# EAGLE design MoleNet_v2 (EAGLE 7.5.0)
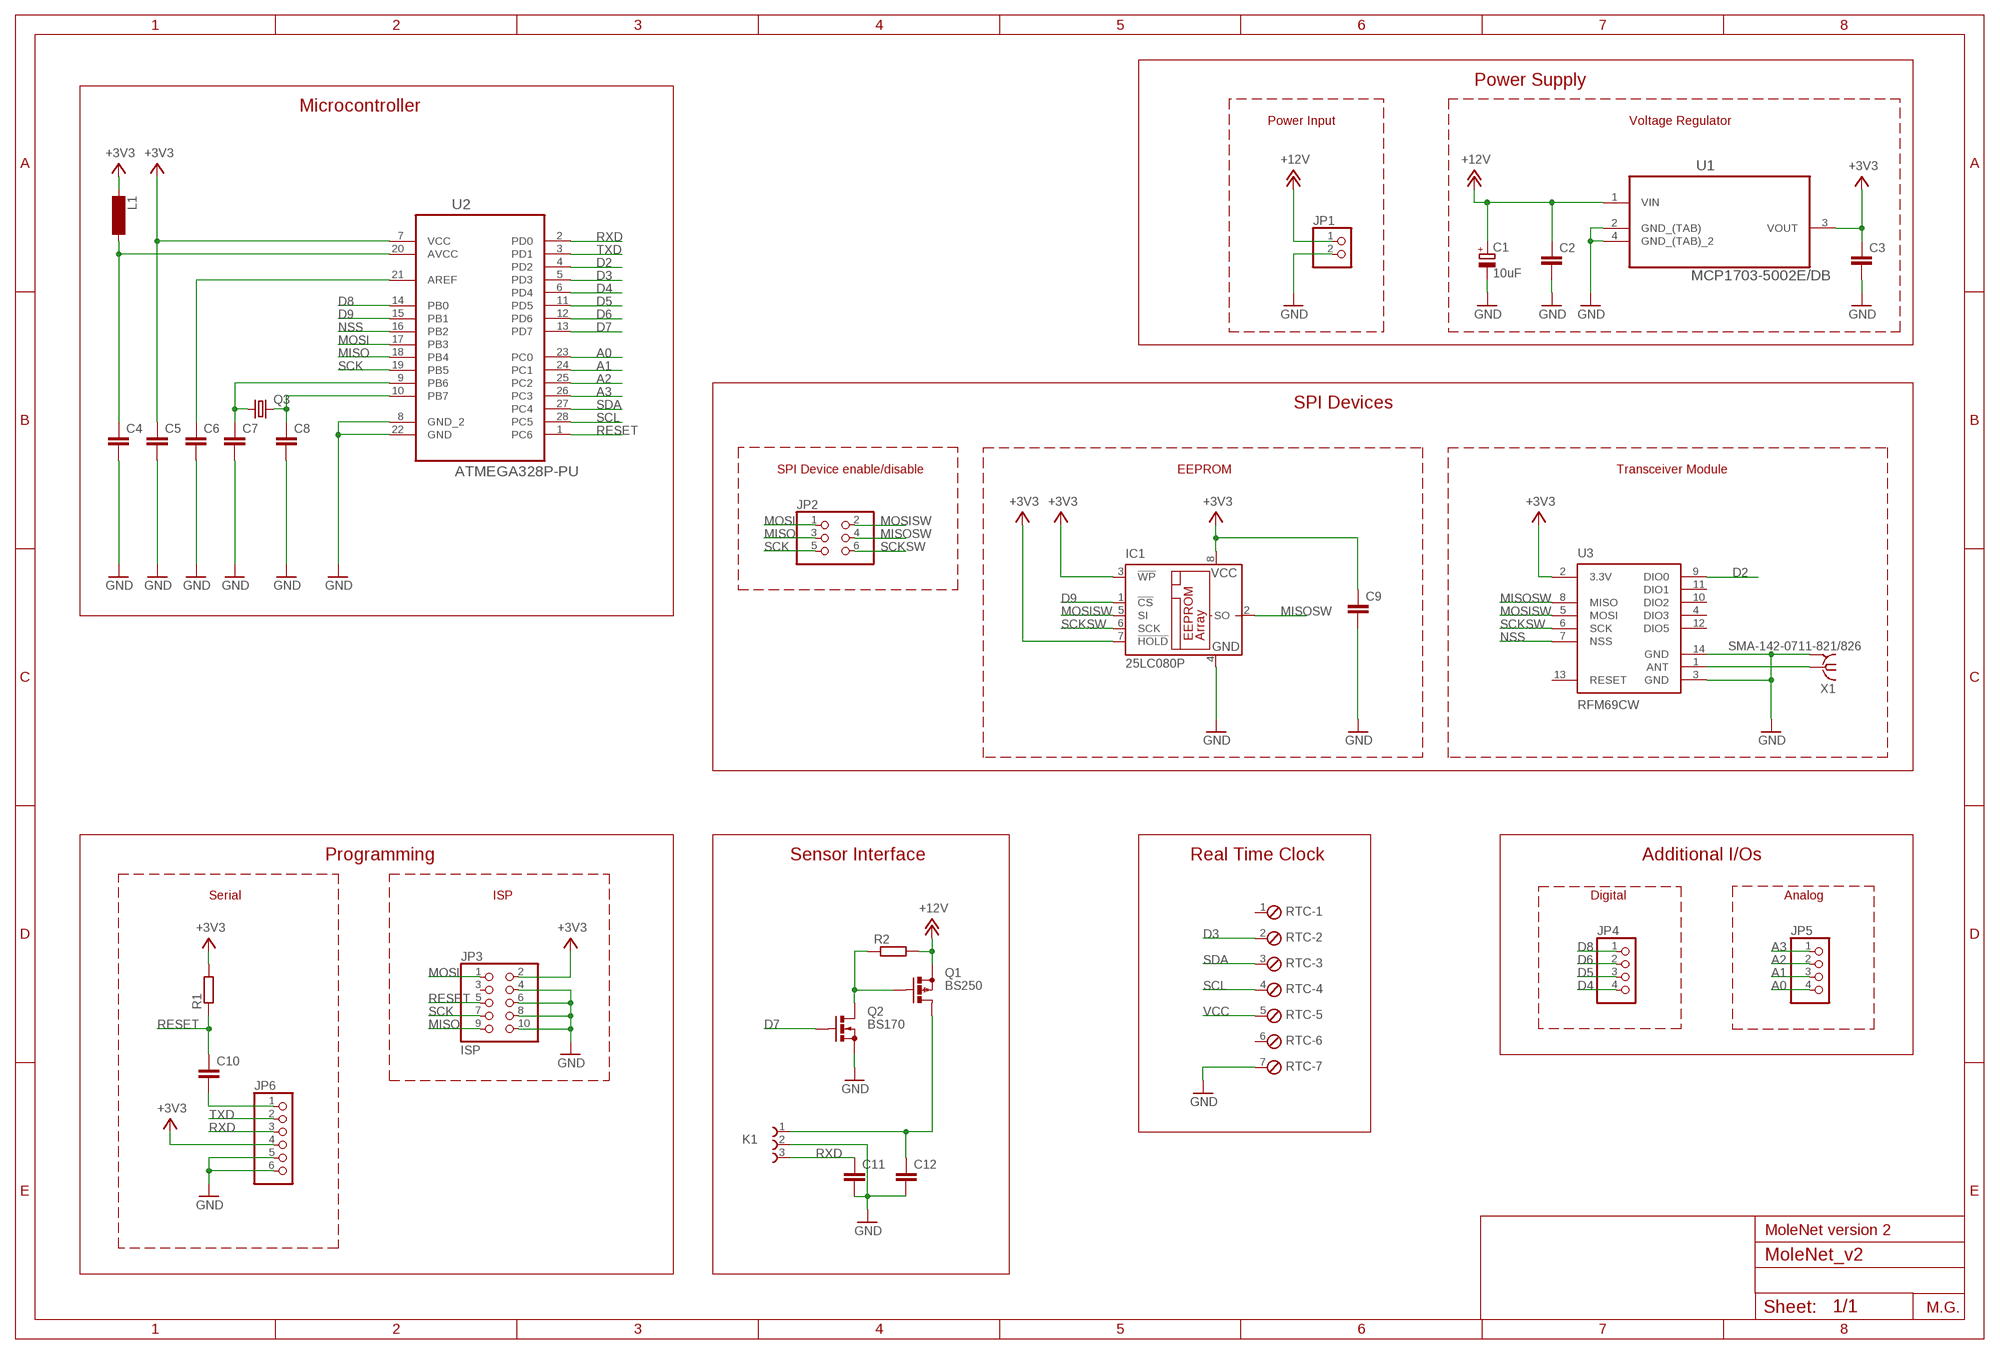
[diagram p0: schematic, sheet 1]

## Parts
C1  10uF  CPOL-EUE2.5-6  [E2,5-6]
C2  C-EU025-025X050  [C025-025X050]
C3  C-EU025-025X050  [C025-025X050]
C4  C-EU025-025X050  [C025-025X050]
C5  C-EU025-025X050  [C025-025X050]
C6  C-EU025-025X050  [C025-025X050]
C7  C-EU025-025X050  [C025-025X050]
C8  C-EU025-025X050  [C025-025X050]
C9  C-EU025-025X050  [C025-025X050]
C10  C-EU025-025X050  [C025-025X050]
C11  C-EU025-025X050  [C025-025X050]
C12  C-EU025-025X050  [C025-025X050]
IC1  25LC080P  [DIL8]
JP1  PINHD-1X2  [1X02]
JP2  PINHD-2X3  [2X03]
JP3  ISP  PINHD-2X5  [2X05]
JP4  PINHD-1X4  [1X04]
JP5  PINHD-1X4  [1X04]
JP6  PINHD-1X6  [1X06]
K1  691241710003  [691241710003]
L1  BS11  [BS11]
Q1  BS250  [SOT54E]
Q2  BS170  [SOT54E]
Q3  CRYSTALHC18U-V  [HC18U-V]
R1  R-EU_0207/10  [0207/10]
R2  R-EU_0207/10  [0207/10]
RTC  MPT7  [7POL254]
U1  MCP1703-5002E/DB  [SOT230P700X180-4N]
U2  ATMEGA328P-PU  [DIP254P762X457-28]
U3  RFM69CW  [RFM69CW-XXXS2]
X1  SMA-142-0711-821/826  [J502-ND-142-0711-821/826]

## Nets
+12V: C1.+ C2.1 JP1.1 Q1.S R2.2 U1.1(VIN)
A0: JP5.4 U2.23(PC0)
A1: JP5.3 U2.24(PC1)
A2: JP5.2 U2.25(PC2)
A3: JP5.1 U2.26(PC3)
D2: U2.4(PD2) U3.9(DIO0)
D3: RTC.2 U2.5(PD3)
D4: JP4.4 U2.6(PD4)
D5: JP4.3 U2.11(PD5)
D6: JP4.2 U2.12(PD6)
D7: Q2.G U2.13(PD7)
D8: JP4.1 U2.14(PB0)
D9: IC1.1(!CS) U2.15(PB1)
GND: C1.- C2.2 C3.2 C4.2 C5.2 C6.2 C7.2 C8.2 C9.2 C11.2 C12.2 IC1.4(GND) JP1.2 JP3.4 JP3.6 JP3.8 JP3.10 JP6.5 JP6.6 K1.2 Q2.S RTC.7 U1.2(GND_(TAB)) U1.4(GND_(TAB)_2) U2.8(GND_2) U2.22(GND) U3.3(GND) U3.14(GND) X1.G@1 X1.G@2 X1.G@3 X1.G@4
MISO: JP2.3 JP3.9 U2.18(PB4)
MISOSW: IC1.2(SO) JP2.4 U3.8(MISO)
MOSI: JP2.1 JP3.1 U2.17(PB3)
MOSISW: IC1.5(SI) JP2.2 U3.5(MOSI)
N$1: Q1.G Q2.D R2.1
N$2: C12.1 K1.1 Q1.D
N$3: C7.1 Q3.1 U2.9(PB6)
N$4: C8.1 Q3.2 U2.10(PB7)
N$5: C4.1 L1.2 U2.20(AVCC)
N$6: C6.1 U2.21(AREF)
N$9: C10.2 JP6.1
N$15: U3.1(ANT) X1.1
NSS: U2.16(PB2) U3.7(NSS)
RESET: C10.1 JP3.5 R1.1 U2.1(PC6)
RXD: C11.1 JP6.3 K1.3 U2.2(PD0)
SCK: JP2.5 JP3.7 U2.19(PB5)
SCKSW: IC1.6(SCK) JP2.6 U3.6(SCK)
SCL: RTC.4 U2.28(PC5)
SDA: RTC.3 U2.27(PC4)
TXD: JP6.2 U2.3(PD1)
VCC: C3.1 C5.1 C9.1 IC1.3(!WP) IC1.7(!HOLD) IC1.8(VCC) JP3.2 JP6.4 L1.1 R1.2 RTC.5 U1.3(VOUT) U2.7(VCC) U3.2(3.3V) ; supply symbol labelled +3V3
Unconnected: JP3.3 RTC.1 RTC.6 U3.4(DIO3) U3.10(DIO2) U3.11(DIO1) U3.12(DIO5) U3.13(RESET)

## Notes on the sheet
- Power Supply
- Microcontroller
- Power Input | Voltage Regulator
- SPI Devices
- SPI Device enable/disable | EEPROM | Transceiver Module
- Programming | Sensor Interface | Real Time Clock | Additional I/Os
- Serial | ISP | Digital | Analog
- MoleNet version 2
- M.G.

## Library data of the parts
C1 = resistor:CPOL-EU: POLARIZED CAPACITOR, European symbol
C2-C12 = resistor:C-EU: CAPACITOR, European symbol
IC1 = microchip:25*: Serial EEPROM 4K/ 8K , SPI bus; MF: MICROCHIP; MPN: 25LC080/P; OC_FARNELL: 1556143; OC_NEWARK: 92C7440
JP1 = pinhead:PINHD-1X2: PIN HEADER
JP2 = pinhead:PINHD-2X3: PIN HEADER
JP3 = pinhead:PINHD-2X5: PIN HEADER
JP4 JP5 = pinhead:PINHD-1X4: PIN HEADER
JP6 = pinhead:PINHD-1X6: PIN HEADER
K1 = Terminal_Blocks_Connectors_rev15e:691241710003: SERIE 2417 - 5.00 MM - HORIZONTAL CABLE ENTRY WITH RISING CAGE CLAMP - WR-TBL =>ConTBL2 691241710003 Characteristics INSULATOR:PA6/66 FLAMABILITY RATING: UL94V0 COLOR: GREEN METAL HOUSING: COPPER ALLOY / Ni+Sn TERMINAL SCREW: STEEL / Zn WIRE GUARD: COPPER ALLOY / Ni+Sn FLANGES NUT: BRASS M2.5 OPERATING TEMPERATURE:-30°C UP TO +120°C COMPLIANCE: LEAD FREE AND ROHS ELECTRICAL UL VDE CURRENT RATING: 14A 14A WORKING VOLTAGE: 300VAC 250VAC WITHSTANDING VOLTAGE: 1,6KV 2KV CONTACT RESISTANCE: 20 mOhm max <http://katalog.we-online.de/media/images/v2/Family_WR-TBL_5_00_2417_HORIZONTAL_CABLE_ENTRY_6912417100XX.jpg> Details see: http://katalog.we-online.de/en/em/TBL_5_00_2417_HORIZONTAL_CABLE_ENTRY_W_RISING_CLAMP_6912417100XX 2015 (C) Wurth Elektronik
L1 = inductor-neosid:BS: INDUCTOR nominal inductance, magnetically screened; OC_FARNELL: unknown; OC_NEWARK: unknown
Q1 = transistor-small-signal:BS250: P-CHANNEL MOS FET
Q2 = transistor-small-signal:BS170: N-CHANNEL MOS FET
Q3 = crystal:CRYSTAL: CRYSTAL; OC_FARNELL: unknown; OC_NEWARK: unknown
R1 R2 = resistor:R-EU_: RESISTOR, European symbol
RTC = con-phoenix-254:MPT7: PHOENIX CONNECTOR; OC_FARNELL: unknown; OC_NEWARK: unknown
U1 = Microchip_By_element14_Batch_1:MCP1703-5002E/DB: IC, LDO REG, 250MA, 5V; MPN: MCP1703-5002E/DB; OC_FARNELL: 1627178; OC_NEWARK: 40M0624; PACKAGE: SOT-223-3; SUPPLIER: Microchip
U2 = Atmel_By_element14_Batch_1-00:ATMEGA328P-PU: 8-bit Microcontroller with In-System Programmable Flash; MPN: ATMEGA328P-PU; OC_FARNELL: 1715487; OC_NEWARK: 15R0268; PACKAGE: PDIP-28; SUPPLIER: Atmel
U3 = SparkFun-RF:RFM69
X1 = con-coax:SMA-: SMA 50 Ohm End Launch Jack Receptacle - Round Contact Johnson Components Source: www.johnsoncomponents.com .. J502-ND.pdf; MF: JOHNSON COMPONENTS; MPN: 142-0711-821; OC_FARNELL: 1019328; OC_NEWARK: 16F3627

## Board
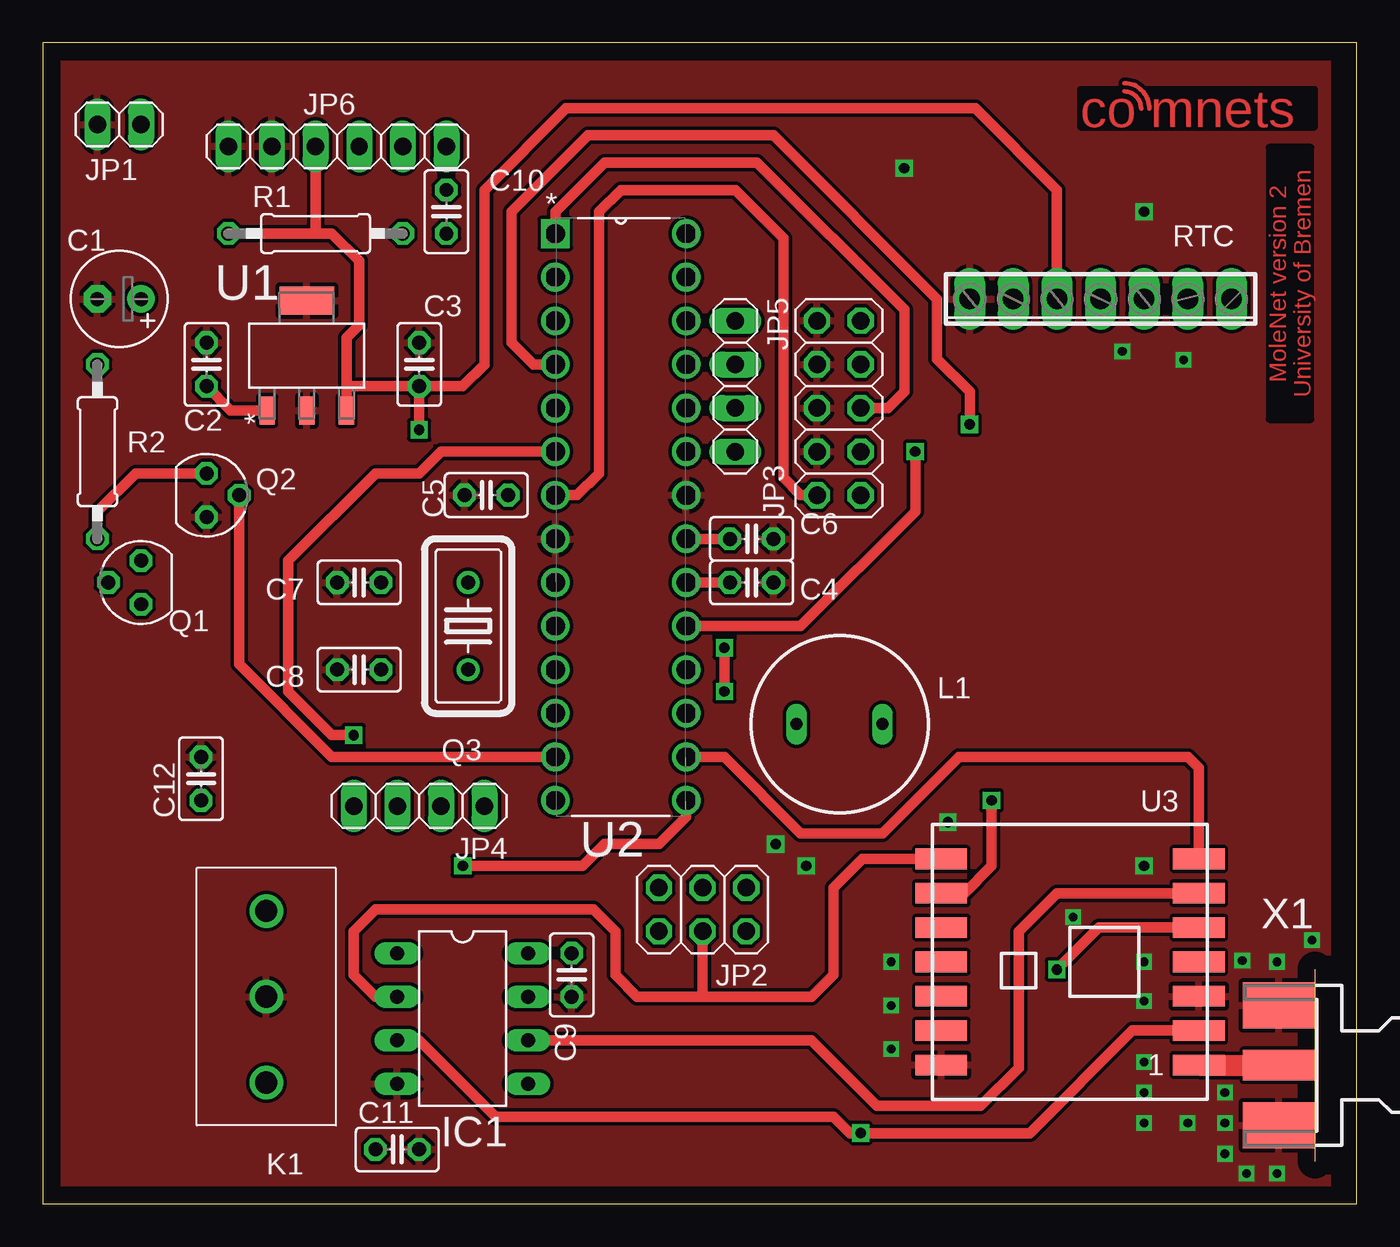
[diagram p1: board, top side]
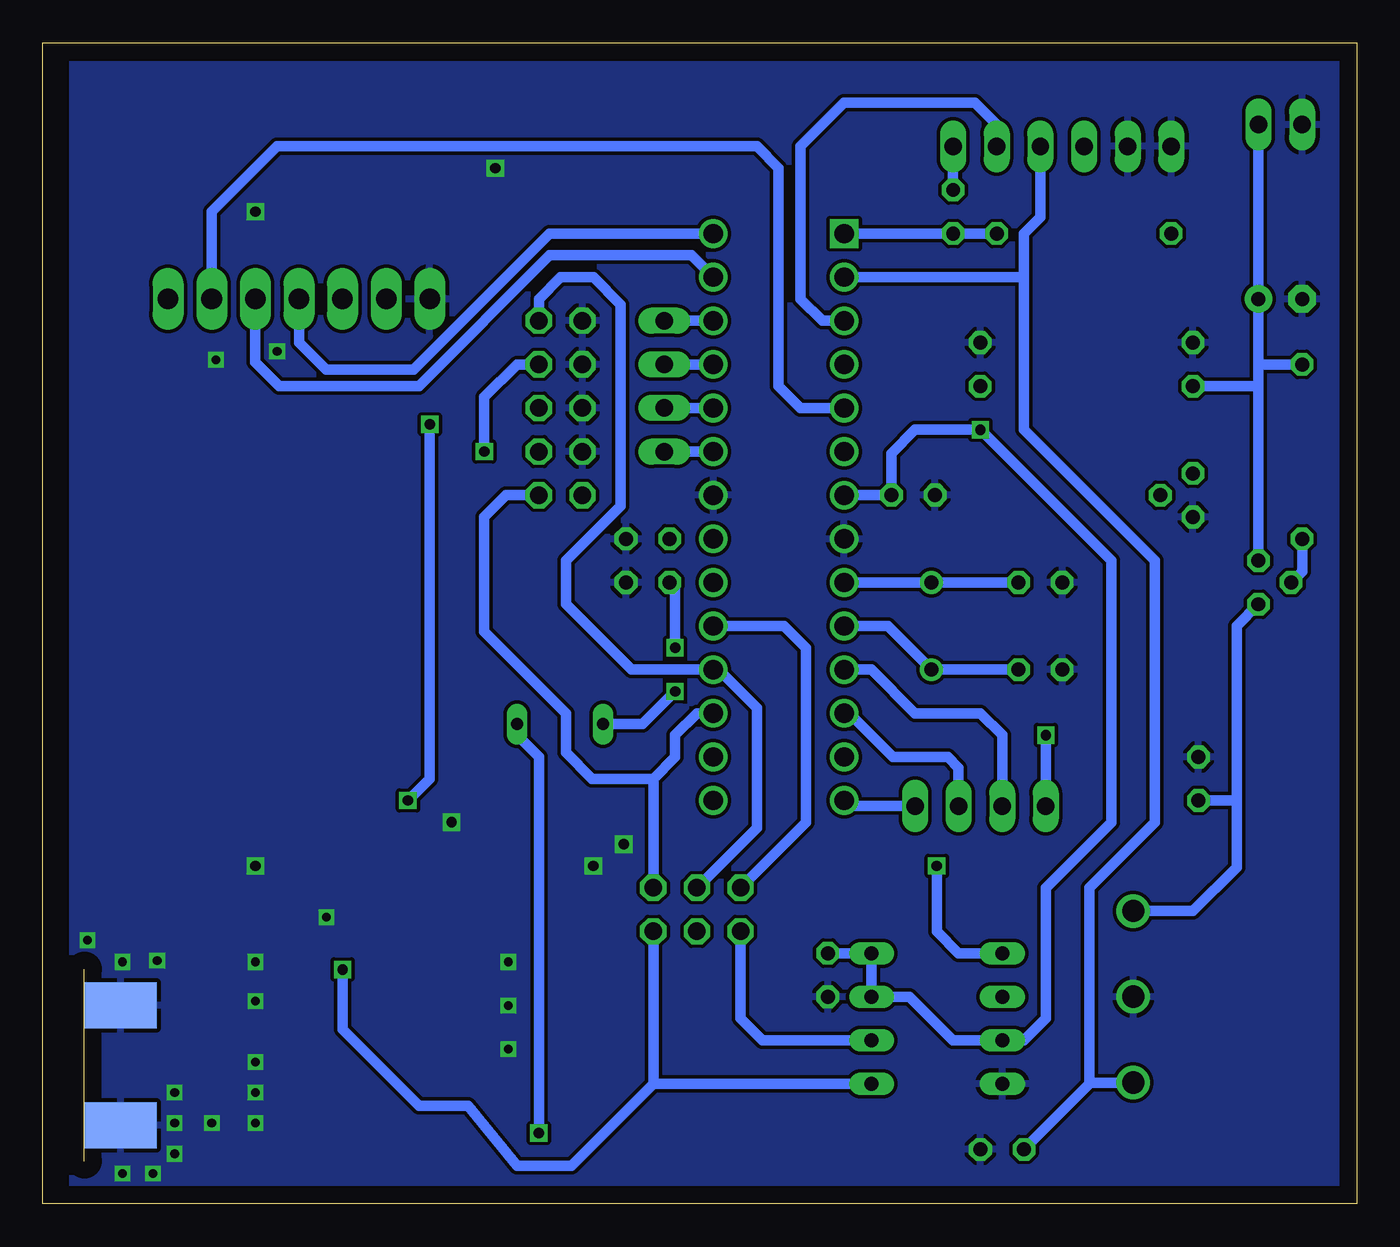
[diagram p2: board, bottom side, seen from below]

Size 76.5 x 67.62 mm. Coordinates in mm from the lower left corner, seen from the top.
Outline: 0,0 76.51,0 76.51,67.62 0,67.62 0,0
Copper layers (1*16): Top 0.035mm / dielectric 1.5mm / Bottom 0.035mm
Design rules "default": minimum track width 10mil, minimum drill 24mil, track to track 8mil, track to pad 8mil, pad to pad 8mil, via to via 8mil, smd to smd 8mil, copper to edge 40mil, drill to drill 8mil, minimum pad ring 10mil, minimum via ring 8mil, stop-mask expansion 4mil, vias tented up to drill 0mil, thermal gap 10mil

### Footprints (pad centres in the part's own frame; a part is rotated, then mirrored left to right if it is on the bottom)
E2,5-6 = drill 0.813 pad 1.6: + -1.27,0 | drill 0.813 pad 1.6 octagon: - 1.27,0
C025-025X050 = drill 0.813 octagon: 1 -1.27,0; 2 1.27,0
DIL8 = drill 0.813 long: 1 -3.81,-3.81; 2 -1.27,-3.81; 3 1.27,-3.81; 4 3.81,-3.81; 5 3.81,3.81; 6 1.27,3.81; 7 -1.27,3.81; 8 -3.81,3.81
1X02 = drill 1.016 long: 1 -1.27,0; 2 1.27,0
2X03 = drill 1.016 octagon: 1 -2.54,-1.27; 2 -2.54,1.27; 3 0,-1.27; 4 0,1.27; 5 2.54,-1.27; 6 2.54,1.27
2X05 = drill 1.016 octagon: 1 -5.08,-1.27; 2 -5.08,1.27; 3 -2.54,-1.27; 4 -2.54,1.27; 5 0,-1.27; 6 0,1.27; 7 2.54,-1.27; 8 2.54,1.27; 9 5.08,-1.27; 10 5.08,1.27
1X04 = drill 1.016 long: 1 -3.81,0; 2 -1.27,0; 3 1.27,0; 4 3.81,0
1X06 = drill 1.016 long: 1 -6.35,0; 2 -3.81,0; 3 -1.27,0; 4 1.27,0; 5 3.81,0; 6 6.35,0
691241710003 = drill 1.3: 1 -5,0; 2 0,0; 3 5,0
BS11 = drill 0.7 long: 1 -2.5,0; 2 2.5,0
SOT54E = drill 0.813 octagon: D -1.27,0; G 0,1.905; S 1.27,0
HC18U-V = drill 0.813: 1 -2.54,0; 2 2.54,0
0207/10 = drill 0.813 octagon: 1 -5.08,0; 2 5.08,0
7POL254 = drill 1.2 long: 1 -7.62,0; 2 -5.08,0; 3 -2.54,0; 4 0,0; 5 2.54,0; 6 5.08,0; 7 7.62,0
SOT230P700X180-4N = smd 1.626 x 0.889: 1 -3.2,2.311; 2 -3.2,0; 3 -3.2,-2.311 | smd 1.626 x 3.175: 4 3.2,0
DIP254P762X457-28 = drill 1.118 square: 1 -7.62,33.02 | drill 1.118: 2 -7.62,30.48; 3 -7.62,27.94; 4 -7.62,25.4; 5 -7.62,22.86; 6 -7.62,20.32; 7 -7.62,17.78; 8 -7.62,15.24; 9 -7.62,12.7; 10 -7.62,10.16; 11 -7.62,7.62; 12 -7.62,5.08; 13 -7.62,2.54; 14 -7.62,0; 15 0,0; 16 0,2.54; 17 0,5.08; 18 0,7.62; 19 0,10.16; 20 0,12.7; 21 0,15.24; 22 0,17.78; 23 0,20.32; 24 0,22.86; 25 0,25.4; 26 0,27.94; 27 0,30.48; 28 0,33.02
RFM69CW-XXXS2 = smd 3 x 1.2: 1 -7.5,6; 2 -7.5,4; 3 -7.5,2; 4 -7.5,0; 5 -7.5,-2; 6 -7.5,-4; 7 -7.5,-6; 8 7.5,-6; 9 7.5,-4; 10 7.5,-2; 11 7.5,0; 12 7.5,2; 13 7.5,4; 14 7.5,6
J502-ND-142-0711-821/826 = smd 4.191 x 1.778: 1 2.115,0 | smd 4.191 x 2.667: G@1 2.115,3.495; G@2 2.115,-3.495 | smd 4.191 x 2.667 bottom: G@3 2.115,3.495; G@4 2.115,-3.495

### Placement (x,y rotation side)
C1  4.45,52.7 180 top
C2  9.53,48.89 90 top
C3  21.92,48.89 90 top
C4  41.28,36.2 0 top
C5  25.82,41.29 180 top
C6  41.28,38.74 0 top
C7  18.41,36.2 180 top
C8  18.41,31.12 180 top
C9  30.8,13.33 270 top
C10  23.49,57.78 90 top
C11  20.64,3.17 0 top
C12  9.21,24.77 90 top
IC1  24.43,10.79 270 top
JP1  4.45,62.86 180 top
JP2  38.42,17.15 180 top
JP3  46.36,46.35 90 top
JP4  21.91,23.18 180 top
JP5  40.32,47.62 270 top
JP6  17.14,61.59 180 top
K1  13,12.06 270 top
L1  46.39,27.94 180 top
Q1  5.71,36.2 90 top
Q2  9.53,41.27 270 top
Q3  24.77,33.66 270 top
R1  15.88,56.52 180 top
R2  3.17,43.81 90 top
RTC  61.6,52.7 180 top
U1  15.37,49.4 90 top
U2  37.47,23.5 0 top
U3  59.82,14.1 180 top
X1  74.09,8.08 180 top

### Tracks (layer width: path | path; a pad name or v marks a point on that pad's centre or on a via)
+12V
  Top 0.61: C2.1 10.95,46.2 U1.1
  Bottom 0.61: JP1.1 C1.+ 5.71,48.89 | Q1.S 5.71,47.62 | 5.71,47.62 5.71,48.89 | C2.1 5.71,47.62 | R2.2 5.71,48.89
A0
  Bottom 0.61: U2.23 JP5.4
A1
  Bottom 0.61: U2.24 JP5.3
A2
  Bottom 0.61: U2.25 JP5.2
A3
  Bottom 0.61: U2.26 JP5.1
D2  (via drill 0.6)
  Top 0.61: v55.25,23.5 55.25,19.69 53.66,18.1 U3.9 | U2.4 28.58,48.89 27.31,50.16 27.31,57.78 31.75,62.23 42.54,62.23 52.07,52.7 52.07,49.21 53.97,47.31 v53.97,45.4
  Bottom 0.61: v55.25,23.5 53.97,24.77 v53.97,45.4
D3
  Bottom 0.61: RTC.2 66.68,57.78 62.86,61.59 34.93,61.59 33.65,60.32 33.65,47.62 32.39,46.35 U2.5
D4  (via drill 0.6)
  Top 0.61: U2.6 23.18,43.81 21.91,42.54 19.37,42.54 14.29,37.46 14.29,29.85 16.83,27.31 v18.1,27.31
  Bottom 0.61: v18.1,27.31 JP4.4
D5
  Bottom 0.61: U2.11 28.26,31.12 25.72,28.58 21.91,28.58 20.64,27.31 JP4.3
D6
  Bottom 0.61: U2.12 29.53,28.58 26.99,26.04 23.81,26.04 23.18,25.4 JP4.2
D7
  Top 0.61: U2.13 16.83,26.04 11.43,31.43 Q2.G
D8
  Bottom 0.61: U2.14 29.53,23.18 JP4.1
D9  (via drill 0.6)
  Top 0.61: U2.15 37.47,22.54 35.88,20.96 32.7,20.96 31.43,19.69 v24.45,19.69
  Bottom 0.61: v24.45,19.69 24.45,15.88 23.18,14.61 IC1.1
GND  (via drill 0.5, 0.6)
  other vias: 73.91,15.37 71.88,14.1 71.88,1.78 69.85,14.16 68.83,4.7 68.83,2.92 68.83,6.48 64.14,14.1 64.14,11.81 64.14,8.26 64.14,4.7 49.4,14.1 49.4,11.56 49.4,9.02 60.01,16.7 66.42,49.15 62.87,49.66 64.14,6.48 70.1,1.78 66.67,4.7 64.14,19.69 52.71,22.23 64.14,57.78 44.45,19.69 42.67,20.96 50.16,60.32
  pour Top: 0.64,66.68 74.8,66.68 74.8,0.89 0.64,0.89
  pour Bottom: 0.64,66.68 74.8,66.68 74.8,0.89 0.64,0.89
MISO
  Bottom 0.61: JP3.9 47.62,52.7 46.36,53.98 44.45,53.98 42.86,52.39 42.86,40.64 46.04,37.46 46.04,34.92 42.23,31.12 U2.18 37.15,31.12 34.93,28.89 34.93,21.91 JP2.3
MISOSW
  Top 0.61: IC1.2 19.37,12.06 18.1,13.33 18.1,15.88 19.37,17.15 32.07,17.15 33.34,15.88 33.34,13.33 34.61,12.06 38.42,12.06 | U3.8 47.72,20.1 46.04,18.42 46.04,13.33 44.77,12.06 38.42,12.06 | 38.42,12.06 JP2.4
MOSI
  Bottom 0.61: JP3.1 49.53,41.27 50.8,40 50.8,33.34 46.04,28.58 46.04,26.29 44.51,24.77 40.96,24.77 | U2.17 38.42,28.58 39.69,27.31 39.69,26.04 40.96,24.77 | JP2.1 40.96,24.77
MOSISW  (via drill 0.6)
  Top 0.61: v59.05,13.65 61.5,16.1 U3.5
  Bottom 0.61: v59.05,13.65 59.05,10.16 54.61,5.71 51.75,5.71 48.9,2.22 45.72,2.22 40.96,6.98 | IC1.5 40.96,6.98 | JP2.2 40.96,6.98
N$1
  Top 0.61: Q2.D 5.4,42.54 3.17,40.32 R2.1
  Bottom 0.61: Q1.G 3.17,36.83 R2.1
N$2
  Bottom 0.61: 6.99,23.5 6.99,19.61 9.52,17.07 K1.1 | C12.1 6.99,23.5 | 6.99,23.5 6.99,33.66 Q1.D
N$3
  Bottom 0.61: U2.9 Q3.1 C7.1
N$4
  Bottom 0.61: C8.1 Q3.2 27.31,33.66 U2.10
N$5  (via drill 0.6)
  Top 0.61: C4.1 U2.20 | v39.69,29.85 v39.69,32.38
  Bottom 0.61: L1.2 41.59,27.94 v39.69,29.85 | v39.69,32.38 39.69,35.88 C4.1
N$6
  Top 0.61: C6.1 U2.21
N$7
  Top 0.254: 62.99,64.8 arc-90 63.96,63.78
N$8
  Top 0.254: 62.99,65.28 arc-90 64.44,63.78
N$9
  Bottom 0.61: C10.2 JP6.1
N$15
  Top 0.61: U3.1 67.34,8.08
  Top 1.219: 67.34,8.08 X1.1
NSS
  Top 0.61: U3.7 67.32,25.39 66.68,26.04 53.34,26.04 48.9,21.59 44.13,21.59 39.69,26.04 U2.16
RESET
  Top 0.61: U2.1 29.84,57.78 32.7,60.64 41.59,60.64 50.16,52.07 50.16,47.31 49.21,46.35 JP3.5
  Bottom 0.61: R1.1 C10.1 U2.1
RXD
  Bottom 0.61: JP6.3 18.42,57.47 19.37,56.52 19.37,53.98 | 19.37,53.98 19.37,45.09 11.75,37.46 11.75,22.23 15.56,18.42 15.56,6.98 | U2.2 19.37,53.98 | 15.56,6.98 C11.1 | K1.3 15.48,7.06 15.56,6.98
SCK  (via drill 0.6)
  Top 0.61: U2.19 44.13,33.66 50.8,40.32 v50.8,43.81
  Bottom 0.61: v50.8,43.81 50.8,46.99 48.9,48.89 JP3.7 | U2.19 33.34,33.66 32.07,32.38 32.07,22.23 JP2.5
SCKSW
  Top 0.61: IC1.6 44.77,9.53 48.58,5.71 54.61,5.71 56.83,7.94 56.83,15.88 59.05,18.1 U3.6
  Bottom 0.61: JP2.6 35.88,10.79 34.61,9.53 IC1.6
SCL
  Bottom 0.61: RTC.4 61.6,50.16 60.01,48.58 54.93,48.58 46.99,56.52 U2.28
SDA
  Bottom 0.61: RTC.3 64.14,49.02 62.74,47.62 54.61,47.62 46.99,55.24 38.73,55.24 U2.27
TXD
  Bottom 0.61: JP6.2 20.95,62.86 22.22,64.14 29.84,64.14 32.39,61.59 32.39,52.7 31.11,51.43 U2.3
VCC  (via drill 0.6)
  Top 0.61: U3.2 63.44,10.1 57.47,4.13 v47.62,4.13 46.99,4.13 46.04,5.08 26.35,5.08 21.91,9.53 IC1.3 | U2.7 31.11,41.27 32.39,42.54 32.39,57.78 33.65,59.05 40.32,59.05 43.12,56.26 43.12,42.29 44.13,41.27 JP3.2 | C3.1 24.45,47.62 25.72,48.89 25.72,59.05 30.48,63.82 54.29,63.82 59.05,59.05 RTC.5 | 15.81,56.52 16.83,56.52 18.42,54.93 18.42,51.18 17.68,50.44 17.68,47.62 | 15.81,56.52 R1.2 | JP6.4 15.87,56.58 15.81,56.52 | v21.91,45.09 21.91,47.61 C3.1 | 17.68,47.62 C3.1 | U1.3 17.68,47.62
  Bottom 0.61: L1.1 48.9,27.31 47.62,26.04 v47.62,4.13 | C9.1 IC1.8 IC1.7 26.04,12.06 23.49,9.53 IC1.3 19.37,9.53 18.1,10.79 18.1,18.42 14.29,22.23 14.29,37.46 v21.91,45.09 25.72,45.09 27.09,43.71 C5.1 27.1,41.27 U2.7

### Text on the board
Top: co mnets | MoleNet version 2 / University of Bremen